# EAGLE design 0.1_proto (EAGLE 5.11)
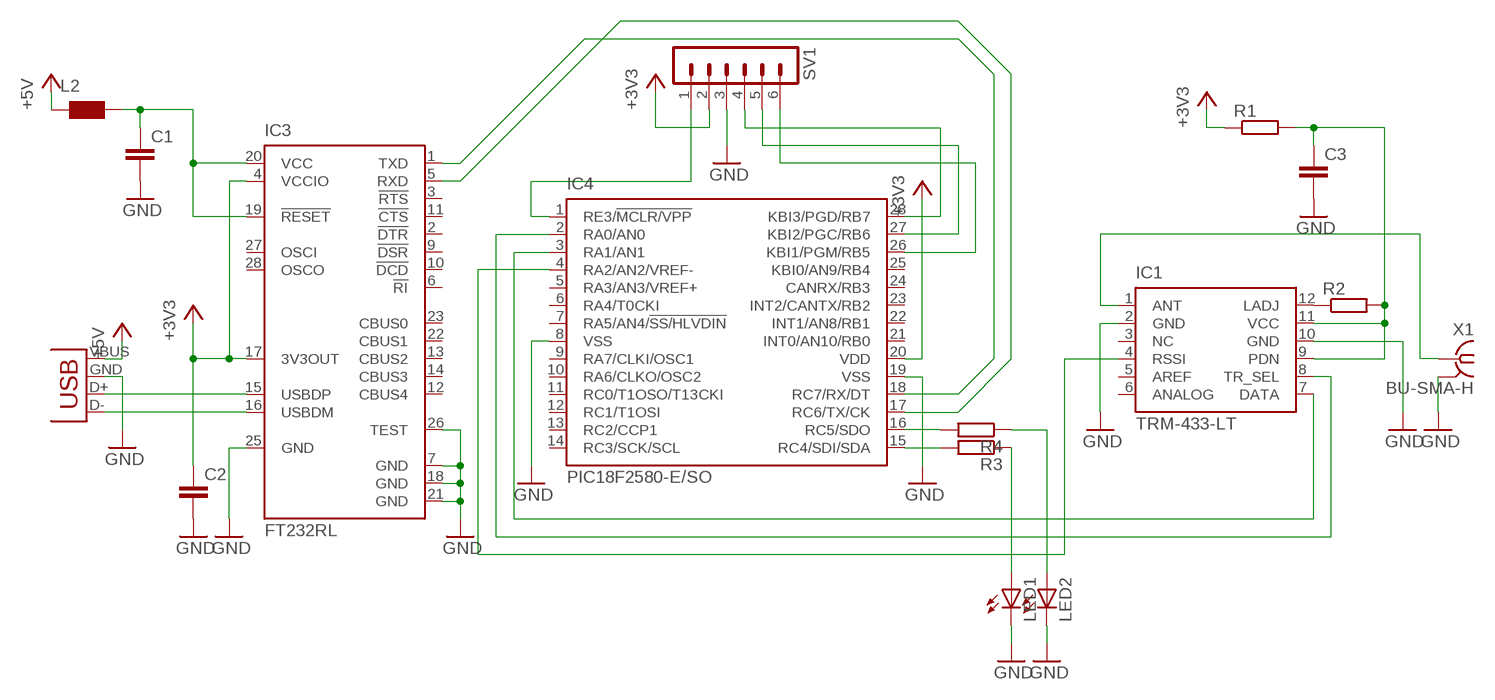
[diagram p0: schematic, sheet 1]

## Parts
C1  C-EUC0805K  [C0805K]
C2  C-EUC0805K  [C0805K]
C3  C-EUC0805K  [C0805K]
IC1  TRM-433-LT  [TRM-XXX-LT]
IC3  FT232RL  [SSOP28]
IC4  PIC18F2580-E/SO  [SO28W]
L2  WE-KIHQ_1008  [WE-KI_1008_B]
LED1  LEDCHIPLED_0805  [CHIPLED_0805]
LED2  LEDCHIPLED_0805  [CHIPLED_0805]
R1  R-EU_M0805  [M0805]
R2  R-EU_M0805  [M0805]
R3  R-EU_M0805  [M0805]
R4  R-EU_M0805  [M0805]
SV1  MA06-1  [MA06-1]
X1  BU-SMA-H  [BU-SMA-H]
X2  USB-A-H  [USB-A-H]

## Nets
+3V3: C2.1 C3.1 IC1.9(PDN) IC1.11(VCC) IC3.4(VCCIO) IC3.17(3V3OUT) IC4.20(VDD) R1.1 R1.2 R2.2 SV1.2
+5V: X2.VBUS(GND)
GND: C1.2 C2.2 C3.2 IC1.2(GND) IC1.10(GND) IC3.7(GND) IC3.18(GND) IC3.21(GND) IC3.25(GND) IC3.26(TEST) IC4.8(VSS) IC4.19(VSS) LED1.C LED2.C SV1.3 X1.2(GND) X2.GND(VBUS)
N$1: IC1.1(ANT) X1.1
N$2: IC3.1(TXD) IC4.18(RC7/RX/DT)
N$3: IC3.5(RXD) IC4.17(RC6/TX/CK)
N$4: IC4.1(RE3/!MCLR/VPP) SV1.1
N$5: IC4.28(KBI3/PGD/RB7) SV1.4
N$6: IC4.27(KBI2/PGC/RB6) SV1.5
N$7: IC4.26(KBI1/PGM/RB5) SV1.6
N$8: IC1.7(DATA) IC4.3(RA1/AN1)
N$9: IC1.8(TR_SEL) IC4.2(RA0/AN0)
N$10: IC1.4(RSSI) IC4.4(RA2/AN2/VREF-)
N$11: IC1.12(LADJ) R2.1
N$12: IC3.16(USBDM) X2.D-(D+)
N$13: IC4.16(RC5/SDO) R4.2
N$14: IC3.15(USBDP) X2.D+(D-)
N$15: IC4.15(RC4/SDI/SDA) R3.2
N$16: C1.1 IC3.19(!RESET) IC3.20(VCC) L2.1
N$18: LED2.A R4.1
N$19: LED1.A R3.1
Unconnected: IC1.3(NC) IC1.5(AREF) IC1.6(ANALOG) IC3.2(!DTR) IC3.3(!RTS) IC3.6(!RI) IC3.9(!DSR) IC3.10(!DCD) IC3.11(!CTS) IC3.12(CBUS4) IC3.13(CBUS2) IC3.14(CBUS3) IC3.22(CBUS1) IC3.23(CBUS0) IC3.27(OSCI) IC3.28(OSCO) IC4.5(RA3/AN3/VREF+) IC4.6(RA4/T0CKI) IC4.7(RA5/AN4/!SS/HLVDIN) IC4.9(RA7/CLKI/OSC1) IC4.10(RA6/CLKO/OSC2) IC4.11(RC0/T1OSO/T13CKI) IC4.12(RC1/T1OSI) IC4.13(RC2/CCP1) IC4.14(RC3/SCK/SCL) IC4.21(INT0/AN10/RB0) IC4.22(INT1/AN8/RB1) IC4.23(INT2/CANTX/RB2) IC4.24(CANRX/RB3) IC4.25(KBI0/AN9/RB4) L2.2

## Power pins joined to a net without a drawn wire
GND: X1.3(GND) X1.4(GND) X1.5(GND)

## Library data of the parts
C1-C3 = rcl:C-EU: CAPACITOR, European symbol
IC1 = linx:TRM-*-LT: LT SERIES TRANSCEIVER MODULE bidirectional wireless transfer serial data Source: www.linxtechnologies.com .. TRM-xxx-LT_Data_Guide.pdf; OC_FARNELL: unknown; OC_NEWARK: unknown
IC3 = ftdichip:FT232R: Source: http://www.ftdichip.com/Documents/DataSheets/DS_FT232R_v104.pdf; MPN: FT232RL; OC_FARNELL: 1146032; OC_NEWARK: 91K9918
IC4 = microchip:PIC18F2*80: 28-Pin Enhanced Flash Microcontrollers with ECAN(TM) Technology 10-Bit A/D and nanoWatt Technology Source: http://www.microchip.com .. 39637a.pdf; MF: MICROCHIP; MPN: PIC18F2580-I/SO; OC_FARNELL: 9321284; OC_NEWARK: 71J7243
L2 = wuerth-elektronik:WE-KIHQ: SMD Wire Wound Ceramic Inductor WE-KIHQ - High current - Highest Quality factor in size 0805 - up to 98 - High thermal stability - High SRF -- Bluetooth -- Wireless LAN -- RF oscillation circuit -- IF impedance matching -- IG choke
LED1 LED2 = led:LED: LED OSRAM: - CHIPLED LG R971, LG N971, LY N971, LG Q971, LY Q971, LO R971, LY R971 LH N974, LH R974 LS Q976, LO Q976, LY Q976 LO Q996 - Hyper CHIPLED LW Q18S LB Q993, LB Q99A, LB R99A - SideLED LS A670, LO A670, LY A670, LG A670, LP A670 LB A673, LV A673, LT A673, LW A673 LH A674 LY A675 LS A676, LA A676, LO A676, LY A676, LW A676 LS A679, LY A679, LG A679 - Hyper Micro SIDELED® LS Y876, LA Y876, LO Y876, LY Y876 LT Y87S - SmartLED LW L88C, LW L88S LB L89C, LB L89S, LG L890 LS L89K, LO L89K, LY L89K LS L896, LA L896, LO L896, LY L896 - TOPLED LS T670, LO T670, LY T670, LG T670, LP T670 LSG T670, LSP T670, LSY T670, LOP T670, LYG T670 LG T671, LOG T671, LSG T671 LB T673, LV T673, LT T673, LW T673 LH T674 LS T676, LA T676, LO T676, LY T676, LB T676, LH T676, LSB T676, LW T676 LB T67C, LV T67C, LT T67C, LS T67K, LO T67K, LY T67K, LW E67C LS E67B, LA E67B, LO E67B, LY E67B, LB E67C, LV E67C, LT E67C LW T67C LS T679, LY T679, LG T679 LS T770, LO T770, LY T770, LG T770, LP T770 LB T773, LV T773, LT T773, LW T773 LH T774 LS E675, LA E675, LY E675, LS T675 LS T776, LA T776, LO T776, LY T776, LB T776 LHGB T686 LT T68C, LB T68C - Hyper Mini TOPLED® LB M676 - Mini TOPLED Santana® LG M470 LS M47K, LO M47K, LY M47K Source: http://www.osram.convergy.de LUXEON: - LUMILED® LXK2-PW12-R00, LXK2-PW12-S00, LXK2-PW14-U00, LXK2-PW14-V00 LXK2-PM12-R00, LXK2-PM12-S00, LXK2-PM14-U00 LXK2-PE12-Q00, LXK2-PE12-R00, LXK2-PE12-S00, LXK2-PE14-T00, LXK2-PE14-U00 LXK2-PB12-K00, LXK2-PB12-L00, LXK2-PB12-M00, LXK2-PB14-N00, LXK2-PB14-P00, LXK2-PB14-Q00 LXK2-PR12-L00, LXK2-PR12-M00, LXK2-PR14-Q00, LXK2-PR14-R00 LXK2-PD12-Q00, LXK2-PD12-R00, LXK2-PD12-S00 LXK2-PH12-R00, LXK2-PH12-S00 LXK2-PL12-P00, LXK2-PL12-Q00, LXK2-PL12-R00 Source: www.luxeon.com KINGBRIGHT: KA-3528ASYC Source: www.kingbright.com
R1-R4 = rcl:R-EU_: RESISTOR, European symbol
SV1 = con-lstb:MA06-1: PIN HEADER; OC_FARNELL: unknown; OC_NEWARK: unknown
X1 = con-coax:BU-SMA-H: FEMALE SMA CONNECTOR Radiall; OC_FARNELL: unknown; OC_NEWARK: unknown
X2 = SparkFun:USB: USB Connectors USB-B-PTH is fully proven SKU : PRT-00139 USB-miniB is fully proven SKU : PRT-00587 USB-A-PCB is untested. USB-A-H is throughly reviewed, but untested. Spark Fun Electronics SKU : PRT-00437 USB-B-SMT is throughly reviewed, but untested. Needs silkscreen touching up. USB-A-S has not been used/tested USB-MB-H has not been used/tested

## Board
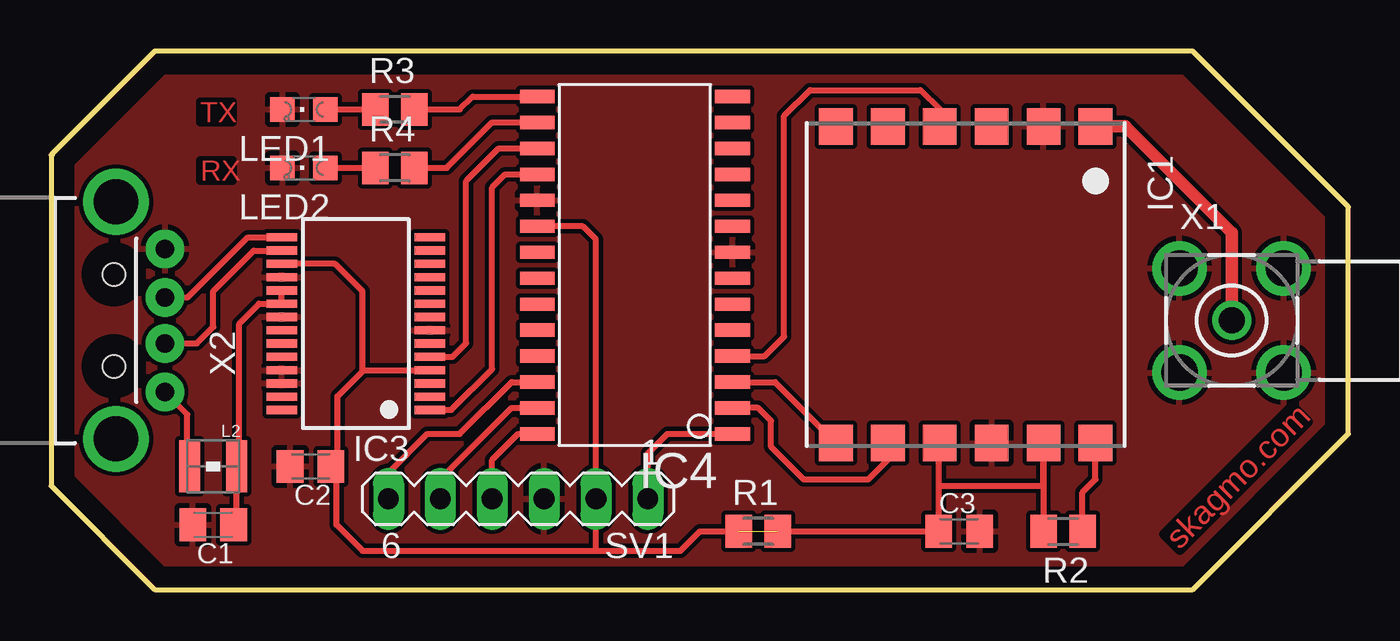
[diagram p1: board, top side]
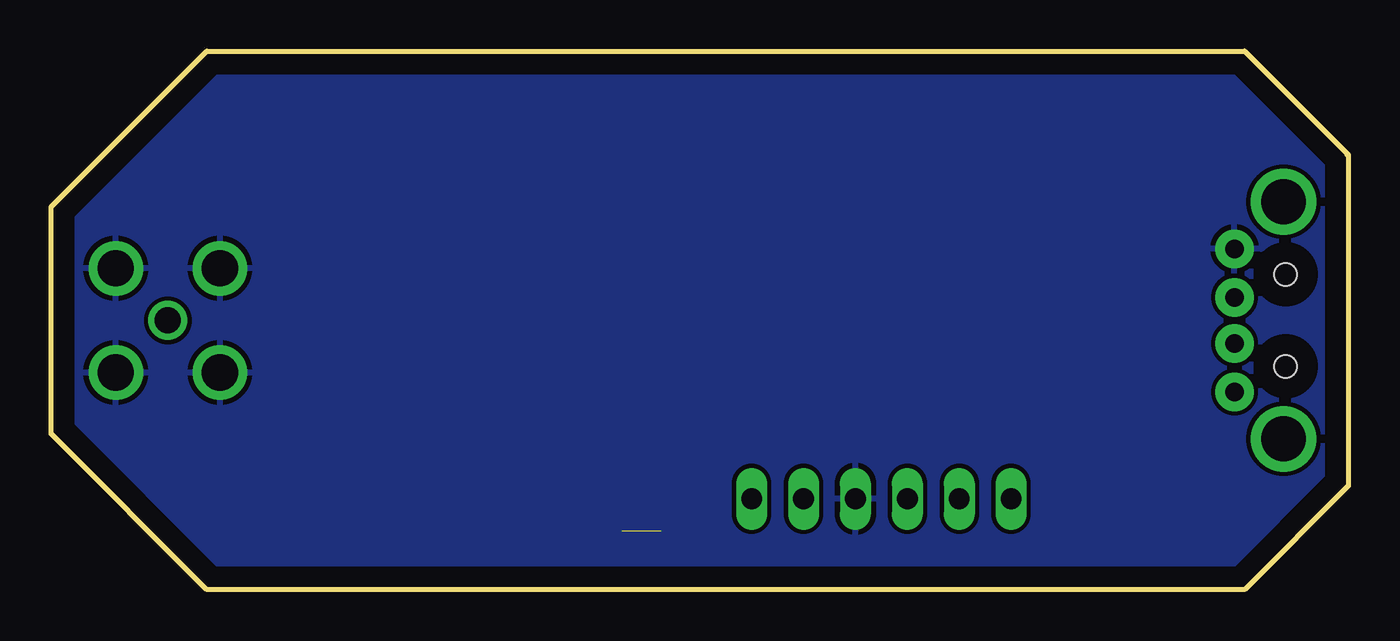
[diagram p2: board, bottom side, seen from below]

Size 63.5 x 26.35 mm. Coordinates in mm from the lower left corner, seen from the top.
Outline: 0,21.27 0,5.08 5.08,0 55.88,0 63.5,7.62 63.5,18.73 55.88,26.35 5.08,26.35 0,21.27
Outline: 0.08,21.27 0,21.27
Outline: 0.16,4.92 0.16,4.92
Copper layers (1*16): Top 0.035mm / dielectric 1.5mm / Bottom 0.035mm
Design rules "default": minimum track width 10mil, minimum drill 24mil, track to track 8mil, track to pad 8mil, pad to pad 8mil, via to via 8mil, smd to smd 8mil, copper to edge 40mil, drill to drill 8mil, minimum pad ring 10mil, minimum via ring 8mil, stop-mask expansion 4mil, vias tented up to drill 0mil, thermal gap 10mil

### Footprints (pad centres in the part's own frame; a part is rotated, then mirrored left to right if it is on the bottom)
C0805K = smd 1.3 x 1.6: 1 -1,0; 2 1,0
TRM-XXX-LT = smd 1.651 x 1.778: 1 -6.35,-7.747; 2 -3.81,-7.747; 3 -1.27,-7.747; 4 1.27,-7.747; 5 3.81,-7.747; 6 6.35,-7.747; 7 6.35,7.747; 8 3.81,7.747; 9 1.27,7.747; 10 -1.27,7.747; 11 -3.81,7.747; 12 -6.35,7.747
SSOP28 = smd 0.4 x 1.5: 1 -4.225,-3.625; 2 -3.575,-3.625; 3 -2.925,-3.625; 4 -2.275,-3.625; 5 -1.625,-3.625; 6 -0.975,-3.625; 7 -0.325,-3.625; 8 0.325,-3.625; 9 0.975,-3.625; 10 1.625,-3.625; 11 2.275,-3.625; 12 2.925,-3.625; 13 3.575,-3.625; 14 4.225,-3.625; 15 4.225,3.625; 16 3.575,3.625; 17 2.925,3.625; 18 2.275,3.625; 19 1.625,3.625; 20 0.975,3.625; 21 0.325,3.625; 22 -0.325,3.625; 23 -0.975,3.625; 24 -1.625,3.625; 25 -2.275,3.625; 26 -2.925,3.625; 27 -3.575,3.625; 28 -4.225,3.625
SO28W = smd 0.65 x 1.7: 1 -7.62,-4.78; 2 -6.35,-4.78; 3 -5.08,-4.78; 4 -3.81,-4.78; 5 -2.54,-4.78; 6 -1.27,-4.78; 7 0,-4.78; 8 1.27,-4.78; 9 2.54,-4.78; 10 3.81,-4.78; 11 5.08,-4.78; 12 6.35,-4.78; 13 7.62,-4.78; 14 8.89,-4.78; 15 8.89,4.78; 16 7.62,4.78; 17 6.35,4.78; 18 5.08,4.78; 19 3.81,4.78; 20 2.54,4.78; 21 1.27,4.78; 22 0,4.78; 23 -1.27,4.78; 24 -2.54,4.78; 25 -3.81,4.78; 26 -5.08,4.78; 27 -6.35,4.78; 28 -7.62,4.78
WE-KI_1008_B = smd 1.02 x 2.54: 1 -1.145,0; 2 1.145,0
CHIPLED_0805 = smd 1.2 x 1.2: A 0,-1.05; C 0,1.05
M0805 = smd 1.3 x 1.6: 1 -0.95,0; 2 0.95,0
MA06-1 = drill 1.016 long: 1 -6.35,0; 2 -3.81,0; 3 -1.27,0; 4 1.27,0; 5 3.81,0; 6 6.35,0
BU-SMA-H = drill 1.27 round: 1 0,0 | drill 1.778 round: 2 -2.55,2.55; 3 2.55,2.55; 4 2.55,-2.55; 5 -2.55,-2.55
USB-A-H = drill 0.914 pad 1.88 round: D+ 2.4,1.127; D- 2.4,-1.127; GND 2.4,3.5; VBUS 2.4,-3.5 | drill 2.2 round: GND2 0,-5.8; GND3 0,5.8 | hole 1.1: -0.1,2.25; -0.1,-2.25

### Placement (x,y rotation side)
C1  7.94,3.17 180 top
C2  12.7,6.03 180 top
C3  44.45,2.86 0 top
IC1  44.77,14.92 180 top
IC3  14.92,13.02 90 top
IC4  28.57,15.24 90 top
L2  7.94,6.03 180 top
LED1  12.38,23.5 90 top
LED2  12.38,20.64 90 top
R1  34.61,2.86 0 top
R2  49.53,2.86 180 top
R3  16.83,23.5 0 top
R4  16.83,20.64 0 top
SV1  22.86,4.45 180 top
X1  57.78,13.18 0 top
X2  3.17,13.18 0 top

### Tracks (layer width: path | path; a pad name or v marks a point on that pad's centre or on a via)
+3V3  (1 unrouted)
  Top 0.305: IC4.20 26.04,17.78 26.67,17.14 SV1.2 26.67,1.91 | 26.67,1.91 15.24,1.91 13.97,3.17 13.97,5.67 C2.1 14.02,6.03 14.02,9.47 15.29,10.74 | IC3.17 13.9,15.94 15.24,14.61 15.24,10.8 15.29,10.74 | 15.29,10.74 IC3.4 | R1.2 C3.1 43.45,5.08 | 43.45,5.08 43.45,7.13 IC1.9 | 26.67,1.91 30.8,1.91 31.75,2.86 R1.1 | R2.2 IC1.11 48.58,5.08 43.45,5.08
GND
  pour Top: -0.32,21.27 -0.32,21.59 4.76,26.67 55.88,26.67 63.82,18.73 63.82,7.3 56.2,-0.32 5.08,-0.32 -0.32,5.08
  pour Bottom: -0.95,21.59 4.76,27.3 56.2,27.3 64.14,19.37 64.14,6.99 56.2,-0.95 4.76,-0.95 -0.95,4.76
N$1
  Top 0.61: IC1.1 52.58,22.67 57.78,17.46 X1.1
N$2
  Top 0.305: IC4.18 22.23,20.32 21.59,19.69 21.59,10.8 19.59,8.79 IC3.1
N$3
  Top 0.305: IC4.17 21.91,21.59 20.32,20 20.32,12.07 19.65,11.39 IC3.5
N$4
  Top 0.305: SV1.1 29.21,6.67 30.16,7.62 IC4.1
N$5
  Top 0.305: IC4.28 22.86,7.62 21.59,6.35 SV1.4
N$6
  Top 0.305: IC4.27 22.54,8.89 19.05,5.4 SV1.5
N$7
  Top 0.305: SV1.6 16.51,5.72 18.41,7.62 20,7.62 22.54,10.16 IC4.26
N$8
  Top 0.305: 38.23,6.99 IC1.7 35.43,10.16 IC4.3
N$9
  Top 0.305: IC1.8 40.96,6.35 40.01,5.4 36.83,5.4 35.24,6.99 35.24,8.25 34.61,8.89 IC4.2
N$10
  Top 0.305: IC4.4 34.92,11.43 35.88,12.38 35.88,23.18 37.15,24.45 42.55,24.45 43.5,23.5 IC1.4
N$11
  Top 0.305: IC1.12 51.12,5.4 50.48,4.76 R2.1
N$12
  Top 0.305: IC3.16 9.93,16.59 7.94,14.61 7.94,12.86 7.13,12.05 X2.D-
N$13
  Top 0.305: R4.2 19.37,20.64 21.59,22.86 IC4.16
N$14
  Top 0.305: IC3.15 9.62,17.24 6.68,14.3 X2.D+
N$15
  Top 0.305: R3.2 20,23.5 20.64,24.13 IC4.15
N$16
  Top 0.305: IC3.19 IC3.20 10.18,13.99 9.21,13.02 9.21,6.16 L2.1 9.08,3.32 C1.1
N$18
  Top 0.305: LED2.A R4.1
N$19
  Top 0.305: LED1.A R3.1
N$20
  Top 0.305: 5.71,9.52 6.67,8.57 6.67,6.03

### Text on the board
Top: TX | RX | skagmo.com